# Altium schematic sheet Supplies_Pots.SchDoc
size 228 x 279 mm
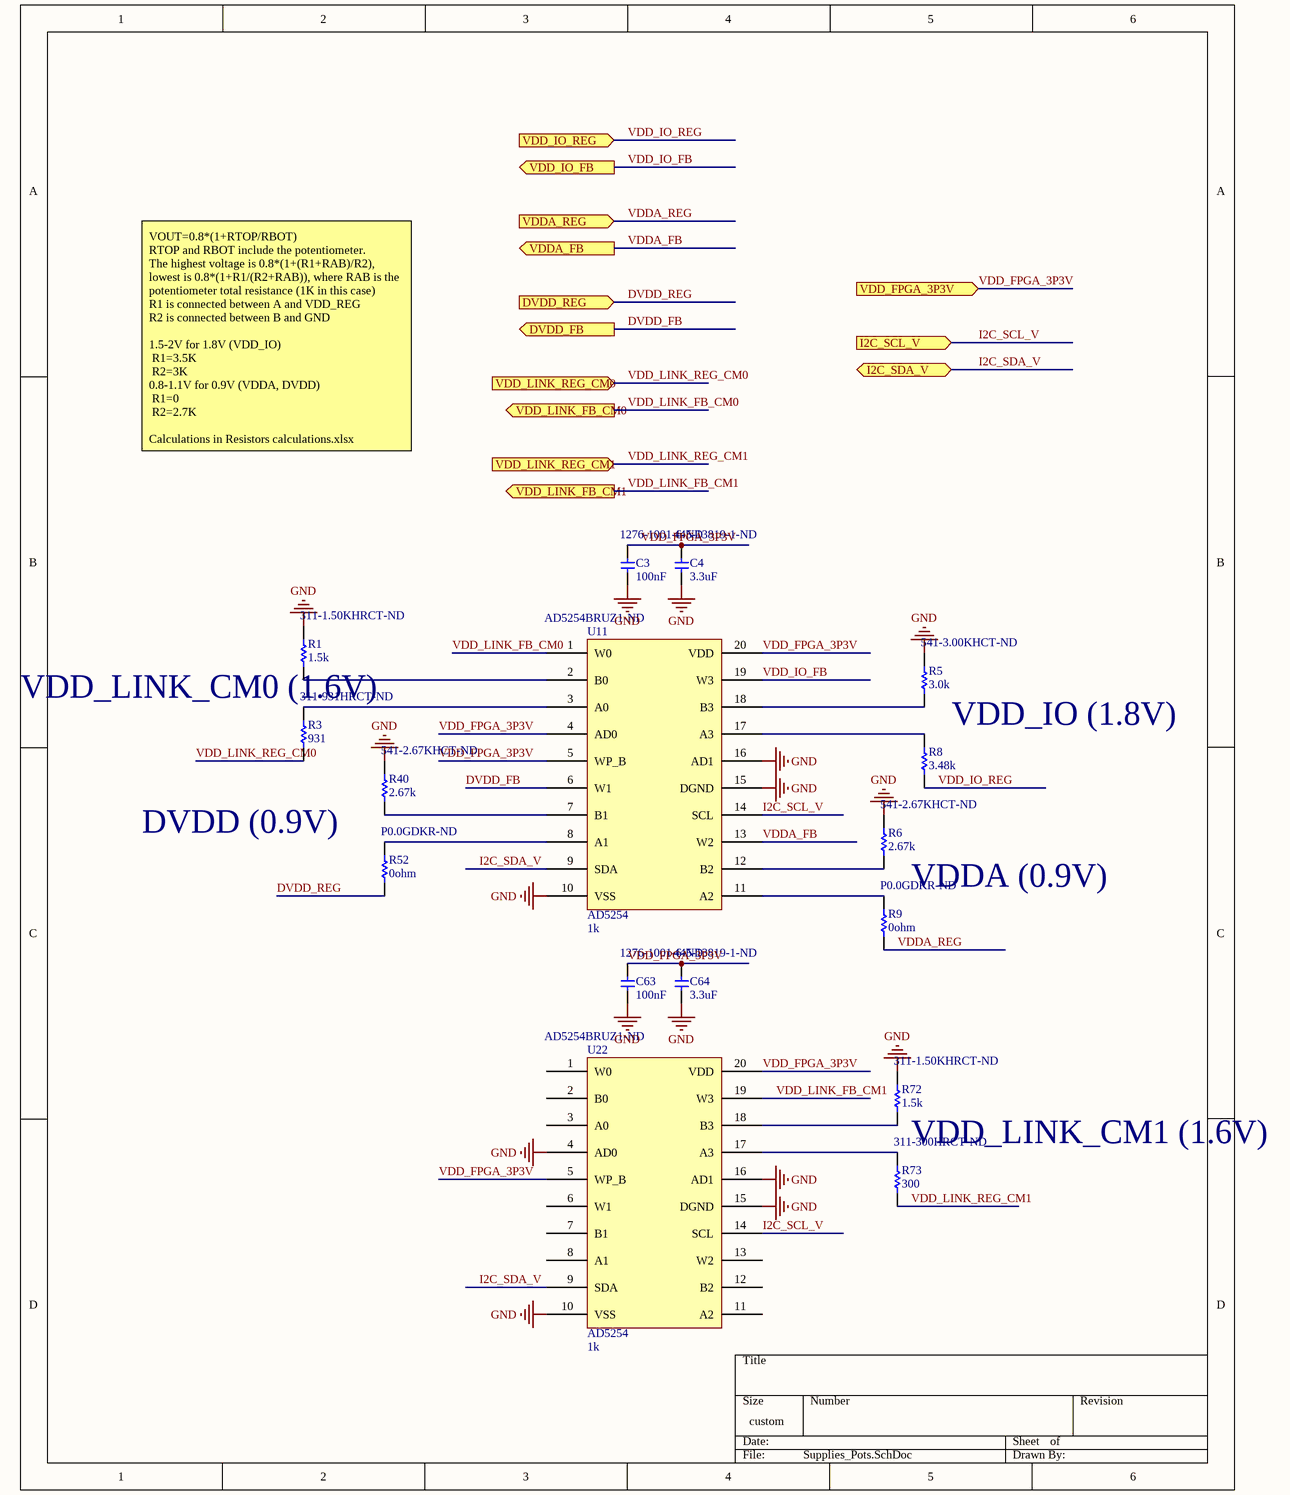
[diagram p0: Supplies_Pots.SchDoc]

## Parts
C3  100nF  Supplier Part Number 1: 1276-1001-6-ND  [CAP_0402]
C4  3.3uF  Supplier Part Number 1: 445-13819-1-ND  [CAP_0402]
C63  100nF  Supplier Part Number 1: 1276-1001-6-ND  [CAP_0402]
C64  3.3uF  Supplier Part Number 1: 445-13819-1-ND  [CAP_0402]
R1  1.5k  Supplier Part Number 1: 311-1.50KHRCT-ND  [RES_0603]
R3  931  Supplier Part Number 1: 311-931HRCT-ND  [RES_0603]
R5  3.0k  Supplier Part Number 1: 541-3.00KHCT-ND  [RES_0603]
R6  2.67k  Supplier Part Number 1: 541-2.67KHCT-ND  [RES_0603]
R8  3.48k  [RES_0603]
R9  0ohm  Supplier Part Number 1: P0.0GDKR-ND  [RES_0603]
R40  2.67k  Supplier Part Number 1: 541-2.67KHCT-ND  [RES_0603]
R52  0ohm  Supplier Part Number 1: P0.0GDKR-ND  [RES_0603]
R72  1.5k  Supplier Part Number 1: 311-1.50KHRCT-ND  [RES_0603]
R73  300  Supplier Part Number 1: 311-300HRCT-ND  [RES_0603]
U11  AD5254  Resistance: 1k  Supplier Part Number 1: AD5254BRUZ1-ND  [AD5254]
U22  AD5254  Resistance: 1k  Supplier Part Number 1: AD5254BRUZ1-ND  [AD5254]

## Ports
DVDD_FB (out), DVDD_REG (in), I2C_SCL_V (in), I2C_SDA_V (bidir), VDD_FPGA_3P3V (in), VDD_IO_FB (out), VDD_IO_REG (in), VDD_LINK_FB_CM0 (out), VDD_LINK_FB_CM1 (out), VDD_LINK_REG_CM0 (in), VDD_LINK_REG_CM1 (in), VDDA_FB (out), VDDA_REG (in)

## Nets
GND: C3.2 C4.2 C63.2 C64.2 R1.1(TOP) R5.1(TOP) R6.1(TOP) R40.1(TOP) R72.1(TOP) U11.10(VSS) U11.15(DGND) U11.16(AD1) U22.4(AD0) U22.10(VSS) U22.15(DGND) U22.16(AD1)
DVDD_FB: U11.6(W1) ; port DVDD_FB
DVDD_REG: R52.2(BOT) ; port DVDD_REG
I2C_SCL_V: U11.14(SCL) U22.14(SCL) ; port I2C_SCL_V
I2C_SDA_V: U11.9(SDA) U22.9(SDA) ; port I2C_SDA_V
VDD_FPGA_3P3V: C3.1 C4.1 C63.1 C64.1 U11.4(AD0) U11.5(WP_B) U11.20(VDD) U22.5(WP_B) U22.20(VDD) ; port VDD_FPGA_3P3V
VDD_IO_FB: U11.19(W3) ; port VDD_IO_FB
VDD_IO_REG: R8.2(BOT) ; port VDD_IO_REG
VDD_LINK_FB_CM0: U11.1(W0) ; port VDD_LINK_FB_CM0
VDD_LINK_FB_CM1: U22.19(W3) ; port VDD_LINK_FB_CM1
VDD_LINK_REG_CM0: R3.2(BOT) ; port VDD_LINK_REG_CM0
VDD_LINK_REG_CM1: R73.2(BOT) ; port VDD_LINK_REG_CM1
VDDA_FB: U11.13(W2) ; port VDDA_FB
VDDA_REG: R9.2(BOT) ; port VDDA_REG
NetR1_2: R1.2(BOT) U11.2(B0)
NetR3_1: R3.1(TOP) U11.3(A0)
NetR5_2: R5.2(BOT) U11.18(B3)
NetR6_2: R6.2(BOT) U11.12(B2)
NetR8_1: R8.1(TOP) U11.17(A3)
NetR9_1: R9.1(TOP) U11.11(A2)
NetR40_2: R40.2(BOT) U11.7(B1)
NetR52_1: R52.1(TOP) U11.8(A1)
NetR72_2: R72.2(BOT) U22.18(B3)
NetR73_1: R73.1(TOP) U22.17(A3)

Not connected (* = marked no-connect by the designer): U22 1(W0) 2(B0) 3(A0) 6(W1) 7(B1) 8(A1) 11(A2) 12(B2) 13(W2)

## Notes on the sheet
- VOUT=0.8*(1+RTOP/RBOT)
  RTOP and RBOT include the potentiometer.
  The highest voltage is 0.8*(1+(R1+RAB)/R2), lowest is 0.8*(1+R1/(R2+RAB)), where RAB is the potentiometer total resistance (1K in this case)
  R1 is connected between A and VDD_REG
  R2 is connected between B and GND
  1.5-2V for 1.8V (VDD_IO)
  R1=3.5K
  R2=3K
  0.8-1.1V for 0.9V (VDDA, DVDD)
  R1=0
  R2=2.7K
  Calculations in Resistors calculations.xlsx
- (near R1) VDD_LINK_CM0 (1.6V)
- VDD_IO (1.8V)
- DVDD (0.9V)
- VDDA (0.9V)
- VDD_LINK_CM1 (1.6V)

## Library data of the parts
C3 C63 = cap 100nF: CAP CER 0.1uF 10% 16V X7R 0402; Manufacturer: Samsung Electro-Mechanics; Manufacturer ID: CL05B104KO5NNNC; Digikey ID: 1276-1001-1-ND; Value: 0.1uF; Package: 0402; Supplier 1: Digi-Key
C4 C64 = cap 3p3uF: CAP CER 3.3uF 10% 10V X5R 0402; Manufacturer: TDK; Manufacturer ID: C1005X5R1A335K050BC; Digikey ID: 445-13819-1-ND; Value: 3.3uF; Package: 0402; Supplier 1: Digi-Key
R1 R72 = res 1.5 kOhm_1: RES SMD 1.5K OHM 1% 1/10W 0603; Package: 0603; Supplier 1: Digi-Key; Supplier 2: Arrow; Supplier Part Number 2: CRCW06031K50FKEA
R3 = res 931 Ohm_1: RES SMD 931 OHM 1% 1/10W 0603; Package: 0603; Supplier 1: Digi-Key; Supplier 2: Digi-Key; Supplier Part Number 2: 541-931HCT-ND
R5 = res 3 kOhm_1: RES SMD 3k OHM 1% 1/10W 0603; Package: 0603; Supplier 1: Digi-Key; Supplier 2: Digi-Key; Supplier Part Number 2: 311-3.00KHRCT-ND
R6 R40 = res 2.67 kOhm_1: RES SMD 2.67kOHM 1% 1/10W 0603; Package: 0603; Supplier 1: Digi-Key; Supplier 2: Digi-Key; Supplier Part Number 2: 311-2.67KHRCT-ND
R8 = res 3.48 kOhm_1: RES SMD 3.48kOHM 1% 1/10W 0603; Package: 0603; Supplier 1: Digi-Key; Supplier Part Number 1: 311-3.48KHRCT-ND; Supplier 2: Digi-Key; Supplier Part Number 2: 541-3.48KHCT-ND
R9 R52 = res 0 ohm 0603: RES SMD 0 OHM JUMPER 1/10W 0603; Manufacturer: Panasonic; Manufacturer ID: ERJ-3GEY0R00V; Digikey ID: P0.0GCT-ND; Package: 0603; Supplier 1: Digi-Key
R73 = res 300 Ohm_1: RES SMD 300 OHM 1% 1/10W 0603; Package: 0603; Supplier 1: Digi-Key; Supplier 2: Digi-Key; Supplier Part Number 2: 541-300HCT-ND
U11 U22 = AD5254: Digital Potentiometer 1k Ohm 4 Circuit 256 Taps I²C Interface 20-TSSOP; Manufacturer: Analog Devices; Manufacturer ID: AD5254BRUZ1; Digikey ID: AD5254BRUZ1-ND; Supplier 1: Digi-Key